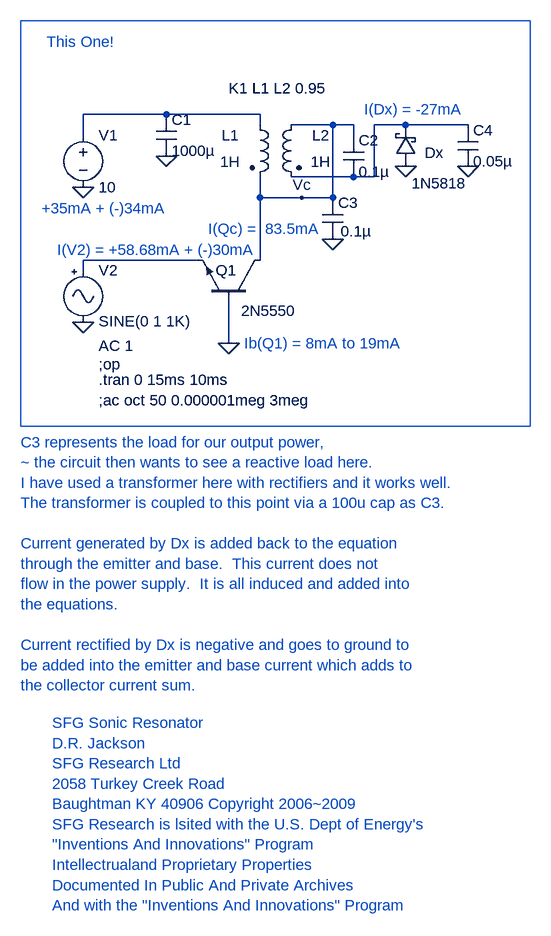
[diagram p0: schematic basic model grounded base.asc]
basic model grounded base.asc, the LTspice schematic file:
Version 4
SHEET 1 1112 1140
WIRE 128 -64 0 -64
WIRE 272 -64 128 -64
WIRE 272 -48 272 -64
WIRE 384 -48 320 -48
WIRE 416 -48 384 -48
WIRE 496 -48 448 -48
WIRE 592 -48 496 -48
WIRE 0 -32 0 -64
WIRE 416 -32 416 -48
WIRE 416 32 320 32
WIRE 448 32 448 -48
WIRE 448 32 416 32
WIRE 272 64 272 32
WIRE 336 64 272 64
WIRE 384 64 384 -48
WIRE 384 64 336 64
WIRE 176 160 0 160
WIRE 272 160 272 64
WIRE 0 176 0 160
WIRE 224 288 224 224
FLAG 224 288 0
FLAG 0 48 0
FLAG 0 256 0
FLAG 496 16 0
FLAG 128 0 0
FLAG 336 64 Vc
FLAG 592 16 0
FLAG 384 128 0
SYMBOL npn 272 224 M270
WINDOW 0 48 68 VLeft 0
WINDOW 3 -14 29 VLeft 0
SYMATTR InstName Q1
SYMATTR Value 2N5550
SYMBOL voltage 0 -48 R0
WINDOW 123 0 0 Left 0
WINDOW 39 0 0 Left 0
SYMATTR InstName V1
SYMATTR Value 10
SYMBOL Misc\\signal 0 160 R0
WINDOW 123 24 132 Left 0
WINDOW 39 0 0 Left 0
WINDOW 3 24 94 Left 0
SYMATTR Value2 AC 1
SYMATTR InstName V2
SYMBOL ind2 256 -64 R0
WINDOW 0 -43 32 Left 0
WINDOW 3 -45 73 Left 0
SYMATTR InstName L1
SYMATTR Value 1H
SYMATTR Type ind
SYMBOL ind2 336 -64 M0
WINDOW 0 -43 32 Left 0
WINDOW 3 -45 73 Left 0
SYMATTR InstName L2
SYMATTR Value 1H
SYMATTR Type ind
SYMBOL schottky 512 16 R180
WINDOW 0 -43 21 Left 0
WINDOW 3 -78 -26 Left 0
SYMATTR InstName Dx
SYMATTR Value 1N5818
SYMATTR Description Diode
SYMATTR Type diode
SYMBOL cap 112 -64 R0
SYMATTR InstName C1
SYMATTR Value 1000µ
SYMBOL cap 400 -32 R0
SYMATTR InstName C2
SYMATTR Value 0.1µ
SYMBOL cap 576 -48 R0
SYMATTR InstName C4
SYMATTR Value 0.05µ
SYMBOL cap 368 64 R0
WINDOW 3 28 52 Left 0
SYMATTR Value 0.1µ
SYMATTR InstName C3
TEXT 24 320 Left 0 !;op
TEXT 24 344 Left 0 !.tran 0 15ms 10ms
TEXT 24 376 Left 0 !;ac oct 50 0.000001meg 3meg
TEXT 224 -104 Left 0 !K1 L1 L2 0.95
TEXT -56 -176 Left 0 ;This One!
TEXT -40 144 Left 0 ;I(V2) = +58.68mA + (-)30mA
TEXT -64 80 Left 0 ;+35mA + (-)34mA
TEXT 432 -72 Left 0 ;I(Dx) = -27mA
TEXT 192 112 Left 0 ;I(Qc) =  83.5mA
TEXT -48 872 Left 0 ;SFG Sonic Resonator\nD.R. Jackson\nSFG Research Ltd\n2058 Turkey Creek Road\nBaughtman KY 40906 Copyright 2006~2009\nSFG Research is lsited with the U.S. Dept of Energy's\n"Inventions And Innovations" Program\nIntellectrualand Proprietary Properties\nDocumented In Public And Private Archives\nAnd with the "Inventions And Innovations" Program
TEXT -96 440 Left 0 ;C3 represents the load for our output power,\n~ the circuit then wants to see a reactive load here.\nI have used a transformer here with rectifiers and it works well.\nThe transformer is coupled to this point via a 100u cap as C3.\n \nCurrent generated by Dx is added back to the equation\nthrough the emitter and base.  This current does not\nflow in the power supply.  It is all induced and added into\nthe equations.\n \nCurrent rectified by Dx is negative and goes to ground to\nbe added into the emitter and base current which adds to \nthe collector current sum.
TEXT 248 288 Left 0 ;Ib(Q1) = 8mA to 19mA
RECTANGLE Normal 688 416 -96 -208

The netlist it stands for:
* basic model grounded base.asc
Q1 Vc 0 N003 0 2N5550
V1 N001 0 10
V2 N003 0 SINE(0 1 1K) AC 1
L1 N001 Vc 1H
L2 Vc N002 1H
Dx 0 N002 1N5818
C1 N001 0 1000µ
C2 Vc N002 0.1µ
C4 N002 0 0.05µ
C3 Vc 0 0.1µ
.model D D
.lib standard.dio
.model NPN NPN
.model PNP PNP
.lib standard.bjt
;op
.tran 0 15ms 10ms
;ac oct 50 0.000001meg 3meg
K1 L1 L2 0.95
* This One!
* I(V2) = +58.68mA + (-)30mA
* +35mA + (-)34mA
* I(Dx) = -27mA
* I(Qc) =  83.5mA
* SFG Sonic Resonator
* D.R. Jackson
* SFG Research Ltd
* 2058 Turkey Creek Road
* Baughtman KY 40906 Copyright 2006~2009
* SFG Research is lsited with the U.S. Dept of Energy's
* "Inventions And Innovations" Program
* Intellectrualand Proprietary Properties
* Documented In Public And Private Archives
* And with the "Inventions And Innovations" Program
* C3 represents the load for our output power,
* ~ the circuit then wants to see a reactive load here.
* I have used a transformer here with rectifiers and it works well.
* The transformer is coupled to this point via a 100u cap as C3.
* Current generated by Dx is added back to the equation
* through the emitter and base.  This current does not
* flow in the power supply.  It is all induced and added into
* the equations.
* Current rectified by Dx is negative and goes to ground to
* be added into the emitter and base current which adds to
* the collector current sum.
* Ib(Q1) = 8mA to 19mA
.backanno
.end